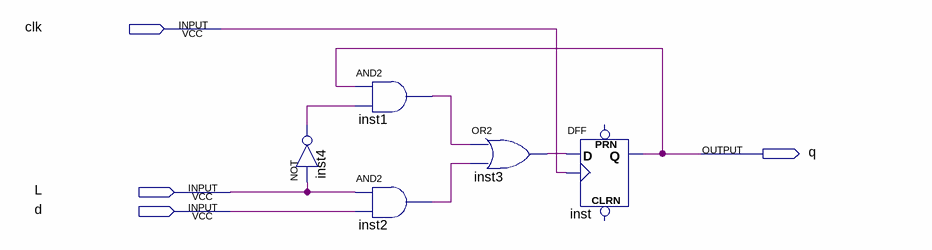
[diagram p0: schematic sheet]
// Quartus schematic reg0.bdf as structural Verilog: 5 symbols, 4 pins
module reg0 (
  input  clk,
  input  L,
  input  d,
  output q
);

  wire inst1_out, inst2_out, inst3_out, inst4_out;

  not inst4 (inst4_out, L);
  and inst1 (inst1_out, q, inst4_out);
  and inst2 (inst2_out, L, d);
  or inst3 (inst3_out, inst1_out, inst2_out);
  DFF inst (.CLK(clk), .D(inst3_out), .Q(q));  // open: CLRN, PRN
endmodule
